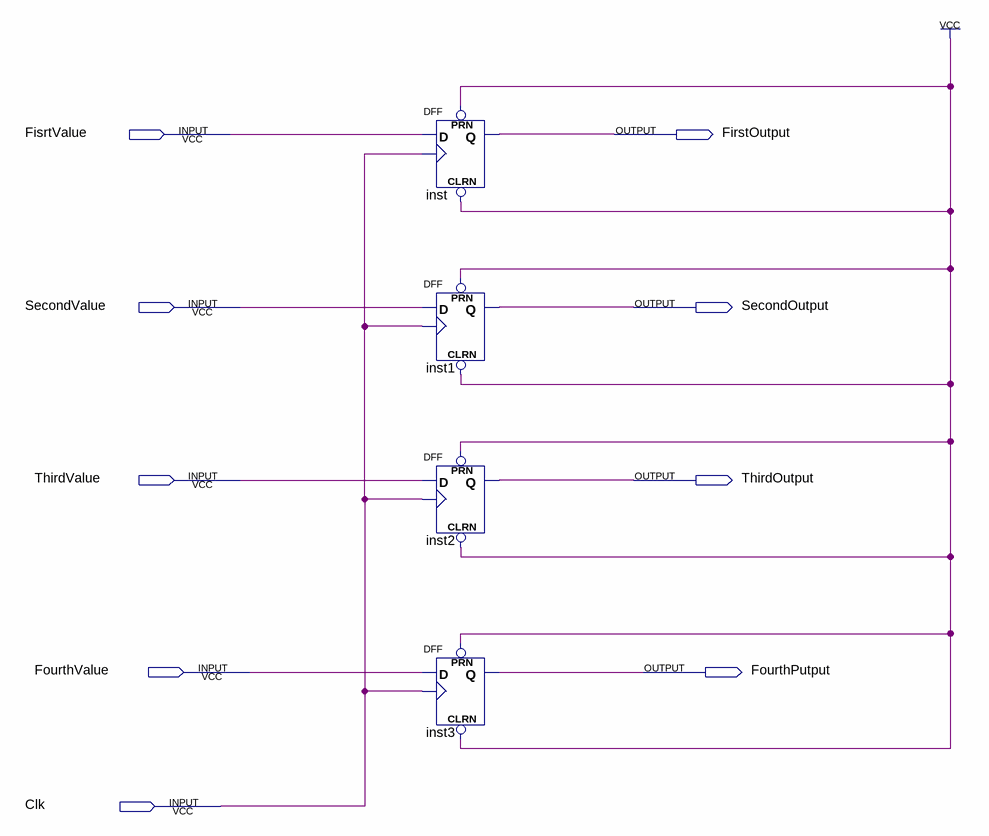
[diagram p0: schematic sheet]
// Quartus schematic 4BitRegister.bdf as structural Verilog: 4 symbols, 9 pins
module \4BitRegister  (
  input  FisrtValue,
  input  SecondValue,
  input  ThirdValue,
  input  FourthValue,
  input  Clk,
  output FirstOutput,
  output SecondOutput,
  output ThirdOutput,
  output FourthPutput
);

  DFF inst (.CLRN(1'b1), .CLK(Clk), .D(FisrtValue), .PRN(1'b1), .Q(FirstOutput));
  DFF inst1 (.CLRN(1'b1), .CLK(Clk), .D(SecondValue), .PRN(1'b1), .Q(SecondOutput));
  DFF inst2 (.CLRN(1'b1), .CLK(Clk), .D(ThirdValue), .PRN(1'b1), .Q(ThirdOutput));
  DFF inst3 (.CLRN(1'b1), .CLK(Clk), .D(FourthValue), .PRN(1'b1), .Q(FourthPutput));
endmodule
